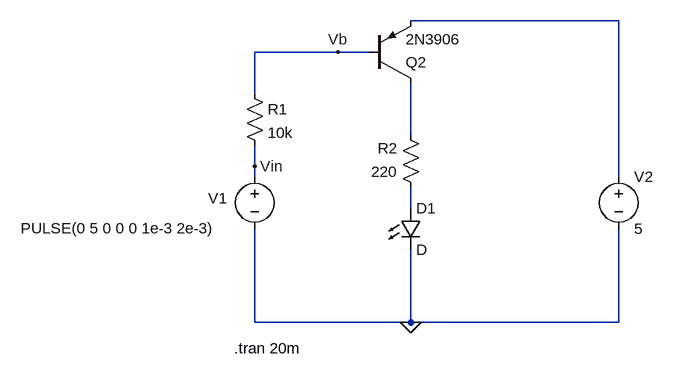
[diagram p0: schematic PNP_LED.asc]
PNP_LED.asc, the LTspice schematic file:
Version 4
SHEET 1 880 680
WIRE 496 -64 176 -64
WIRE 64 -16 -64 -16
WIRE 112 -16 64 -16
WIRE -64 48 -64 -16
WIRE 176 112 176 32
WIRE -64 160 -64 128
WIRE -64 176 -64 160
WIRE 496 176 496 -64
WIRE 176 224 176 192
WIRE -64 400 -64 256
WIRE 176 400 176 288
WIRE 176 400 -64 400
WIRE 496 400 496 256
WIRE 496 400 176 400
FLAG 176 400 0
FLAG 64 -16 Vb
FLAG -64 160 Vin
SYMBOL res -80 32 R0
SYMATTR InstName R1
SYMATTR Value 10k
SYMBOL voltage -64 160 R0
WINDOW 123 0 0 Left 0
WINDOW 39 0 0 Left 0
WINDOW 3 -360 95 Left 2
WINDOW 0 -72 49 Left 2
SYMATTR Value PULSE(0 5 0 0 0 1e-3 2e-3)
SYMATTR InstName V1
SYMBOL voltage 496 160 R0
WINDOW 123 0 0 Left 0
WINDOW 39 0 0 Left 0
SYMATTR InstName V2
SYMATTR Value 5
SYMBOL res 192 208 R180
WINDOW 0 36 76 Left 2
WINDOW 3 36 40 Left 2
SYMATTR InstName R2
SYMATTR Value 220
SYMBOL LED 160 224 R0
SYMATTR InstName D1
SYMBOL pnp 112 32 M180
SYMATTR InstName Q2
SYMATTR Value 2N3906
TEXT -96 440 Left 2 !.tran 20m

The netlist it stands for:
* PNP_LED.asc
R1 Vb Vin 10k
V1 Vin 0 PULSE(0 5 0 0 0 1e-3 2e-3)
V2 N001 0 5
R2 N003 N002 220
D1 N003 0 D
Q2 N002 Vb N001 0 2N3906
.model D D
.lib standard.dio
.model NPN NPN
.model PNP PNP
.lib standard.bjt
.tran 20m
.backanno
.end